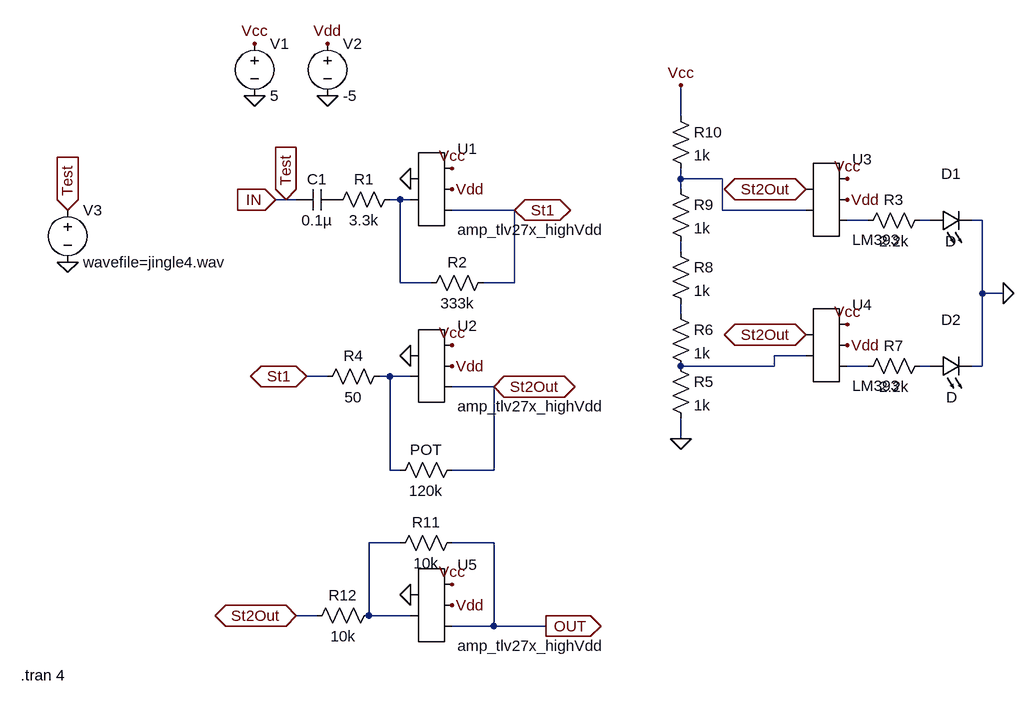
[diagram p0: schematic prelab.asc]
prelab.asc, the LTspice schematic file:
Version 4
SHEET 1 1316 1132
WIRE 800 32 800 -16
WIRE 800 128 800 112
WIRE 864 128 800 128
WIRE 800 144 800 128
WIRE 192 160 176 160
WIRE 208 160 192 160
WIRE 368 160 352 160
WIRE 384 160 368 160
WIRE 544 176 448 176
WIRE 864 176 864 128
WIRE 992 176 864 176
WIRE 1088 192 1056 192
WIRE 1184 192 1168 192
WIRE 1264 192 1248 192
WIRE 800 240 800 224
WIRE 368 288 368 160
WIRE 416 288 368 288
WIRE 544 288 544 176
WIRE 544 288 496 288
WIRE 1264 304 1264 192
WIRE 1296 304 1264 304
WIRE 800 336 800 320
WIRE 992 400 944 400
WIRE 944 416 944 400
WIRE 944 416 800 416
WIRE 1088 416 1056 416
WIRE 1184 416 1168 416
WIRE 1264 416 1264 304
WIRE 1264 416 1248 416
WIRE 256 432 224 432
WIRE 352 432 336 432
WIRE 384 432 352 432
WIRE 512 448 448 448
WIRE 800 528 800 496
WIRE 352 576 352 432
WIRE 368 576 352 576
WIRE 512 576 512 448
WIRE 512 576 448 576
WIRE 368 688 320 688
WIRE 512 688 448 688
WIRE 240 800 208 800
WIRE 320 800 320 688
WIRE 384 800 320 800
WIRE 512 816 512 688
WIRE 512 816 448 816
WIRE 592 816 512 816
FLAG 176 160 IN
IOPIN 176 160 In
FLAG 384 128 0
FLAG 256 0 0
FLAG 144 0 0
FLAG 144 -80 Vcc
FLAG 256 -80 Vdd
FLAG 448 112 Vcc
FLAG 448 144 Vdd
FLAG 384 400 0
FLAG 448 384 Vcc
FLAG 448 416 Vdd
FLAG 512 448 St2Out
IOPIN 512 448 BiDir
FLAG 544 176 St1
IOPIN 544 176 BiDir
FLAG 224 432 St1
IOPIN 224 432 BiDir
FLAG 800 528 0
FLAG 992 144 St2Out
IOPIN 992 144 BiDir
FLAG 992 368 St2Out
IOPIN 992 368 BiDir
FLAG 800 -16 Vcc
FLAG 1056 128 Vcc
FLAG 1056 352 Vcc
FLAG 1056 160 Vdd
FLAG 1056 384 Vdd
FLAG 1296 304 0
FLAG -144 256 0
FLAG -144 176 Test
IOPIN -144 176 In
FLAG 192 160 Test
IOPIN 192 160 In
FLAG 592 816 OUT
IOPIN 592 816 Out
FLAG 208 800 St2Out
IOPIN 208 800 BiDir
FLAG 448 752 Vcc
FLAG 448 784 Vdd
FLAG 384 768 0
SYMBOL cap 272 144 R90
WINDOW 0 0 32 VBottom 2
WINDOW 3 32 32 VTop 2
SYMATTR InstName C1
SYMATTR Value 0.1µ
SYMBOL res 368 144 R90
WINDOW 0 0 56 VBottom 2
WINDOW 3 32 56 VTop 2
SYMATTR InstName R1
SYMATTR Value 3.3k
SYMBOL AutoGenerated\\amp_tlv27x_highVdd 416 144 R0
SYMATTR InstName U1
SYMBOL voltage 144 -96 R0
WINDOW 123 0 0 Left 0
WINDOW 39 0 0 Left 0
SYMATTR InstName V1
SYMATTR Value 5
SYMBOL voltage 256 -96 R0
WINDOW 123 0 0 Left 0
WINDOW 39 0 0 Left 0
SYMATTR InstName V2
SYMATTR Value -5
SYMBOL AutoGenerated\\amp_tlv27x_highVdd 416 416 R0
SYMATTR InstName U2
SYMBOL res 464 560 R90
WINDOW 0 0 56 VBottom 2
WINDOW 3 32 56 VTop 2
SYMATTR InstName POT
SYMATTR Value 120k
SYMBOL res 352 416 R90
WINDOW 0 0 56 VBottom 2
WINDOW 3 32 56 VTop 2
SYMATTR InstName R4
SYMATTR Value 50
SYMBOL AutoGenerated\\LM393 1024 160 R0
SYMATTR InstName U3
SYMBOL AutoGenerated\\LM393 1024 384 R0
SYMATTR InstName U4
SYMBOL res 784 400 R0
SYMATTR InstName R5
SYMATTR Value 1k
SYMBOL res 784 224 R0
SYMATTR InstName R8
SYMATTR Value 1k
SYMBOL res 784 128 R0
SYMATTR InstName R9
SYMATTR Value 1k
SYMBOL res 784 16 R0
SYMATTR InstName R10
SYMATTR Value 1k
SYMBOL res 784 320 R0
SYMATTR InstName R6
SYMATTR Value 1k
SYMBOL LED 1184 208 R270
WINDOW 0 72 32 VTop 2
WINDOW 3 0 32 VBottom 2
SYMATTR InstName D1
SYMBOL LED 1184 432 R270
WINDOW 0 72 32 VTop 2
WINDOW 3 -16 33 VBottom 2
SYMATTR InstName D2
SYMBOL res 512 272 R90
WINDOW 0 0 56 VBottom 2
WINDOW 3 32 56 VTop 2
SYMATTR InstName R2
SYMATTR Value 333k
SYMBOL res 1184 176 R90
WINDOW 0 0 56 VBottom 2
WINDOW 3 32 56 VTop 2
SYMATTR InstName R3
SYMATTR Value 2.2k
SYMBOL res 1184 400 R90
WINDOW 0 0 56 VBottom 2
WINDOW 3 32 56 VTop 2
SYMATTR InstName R7
SYMATTR Value 2.2k
SYMBOL AutoGenerated\\amp_tlv27x_highVdd 416 784 R0
SYMATTR InstName U5
SYMBOL res 464 672 R90
WINDOW 0 0 56 VBottom 2
WINDOW 3 32 56 VTop 2
SYMATTR InstName R11
SYMATTR Value 10k
SYMBOL res 336 784 R90
WINDOW 0 0 56 VBottom 2
WINDOW 3 32 56 VTop 2
SYMATTR InstName R12
SYMATTR Value 10k
SYMBOL voltage -144 160 R0
SYMATTR InstName V3
SYMATTR Value wavefile=jingle4.wav
TEXT -216 892 Left 2 !.tran 4

The netlist it stands for:
* prelab.asc
C1 P001 Test 0.1µ
R1 N002 P001 3.3k
* U1: amp_tlv27x_highVdd (symbol AutoGenerated\amp_tlv27x_highVdd not available, pins judged from their places): pin1=0 pin2=N002 pin3=Vcc pin4=Vdd pin5=St1
V1 Vcc 0 5
V2 Vdd 0 -5
* U2: amp_tlv27x_highVdd (symbol AutoGenerated\amp_tlv27x_highVdd not available, pins judged from their places): pin1=0 pin2=N010 pin3=Vcc pin4=Vdd pin5=St2Out
R§POT St2Out N010 120k
R4 N010 St1 50
* U3: LM393 (symbol AutoGenerated\LM393 not available, pins judged from their places): pin1=St2Out pin2=N001 pin3=Vcc pin4=Vdd pin5=N003
* U4: LM393 (symbol AutoGenerated\LM393 not available, pins judged from their places): pin1=St2Out pin2=N007 pin3=Vcc pin4=Vdd pin5=N008
R5 N007 0 1k
R8 N005 N006 1k
R9 N001 N005 1k
R10 Vcc N001 1k
R6 N006 N007 1k
D1 N004 0 D
D2 N009 0 D
R2 St1 N002 333k
R3 N004 N003 2.2k
R7 N009 N008 2.2k
* U5: amp_tlv27x_highVdd (symbol AutoGenerated\amp_tlv27x_highVdd not available, pins judged from their places): pin1=0 pin2=N011 pin3=Vcc pin4=Vdd pin5=OUT
R11 OUT N011 10k
R12 N011 St2Out 10k
V3 Test 0 wavefile=jingle4.wav
.model D D
.lib standard.dio
.tran 4
.backanno
.end